# EAGLE schematic norsid (EAGLE 9.6.2)
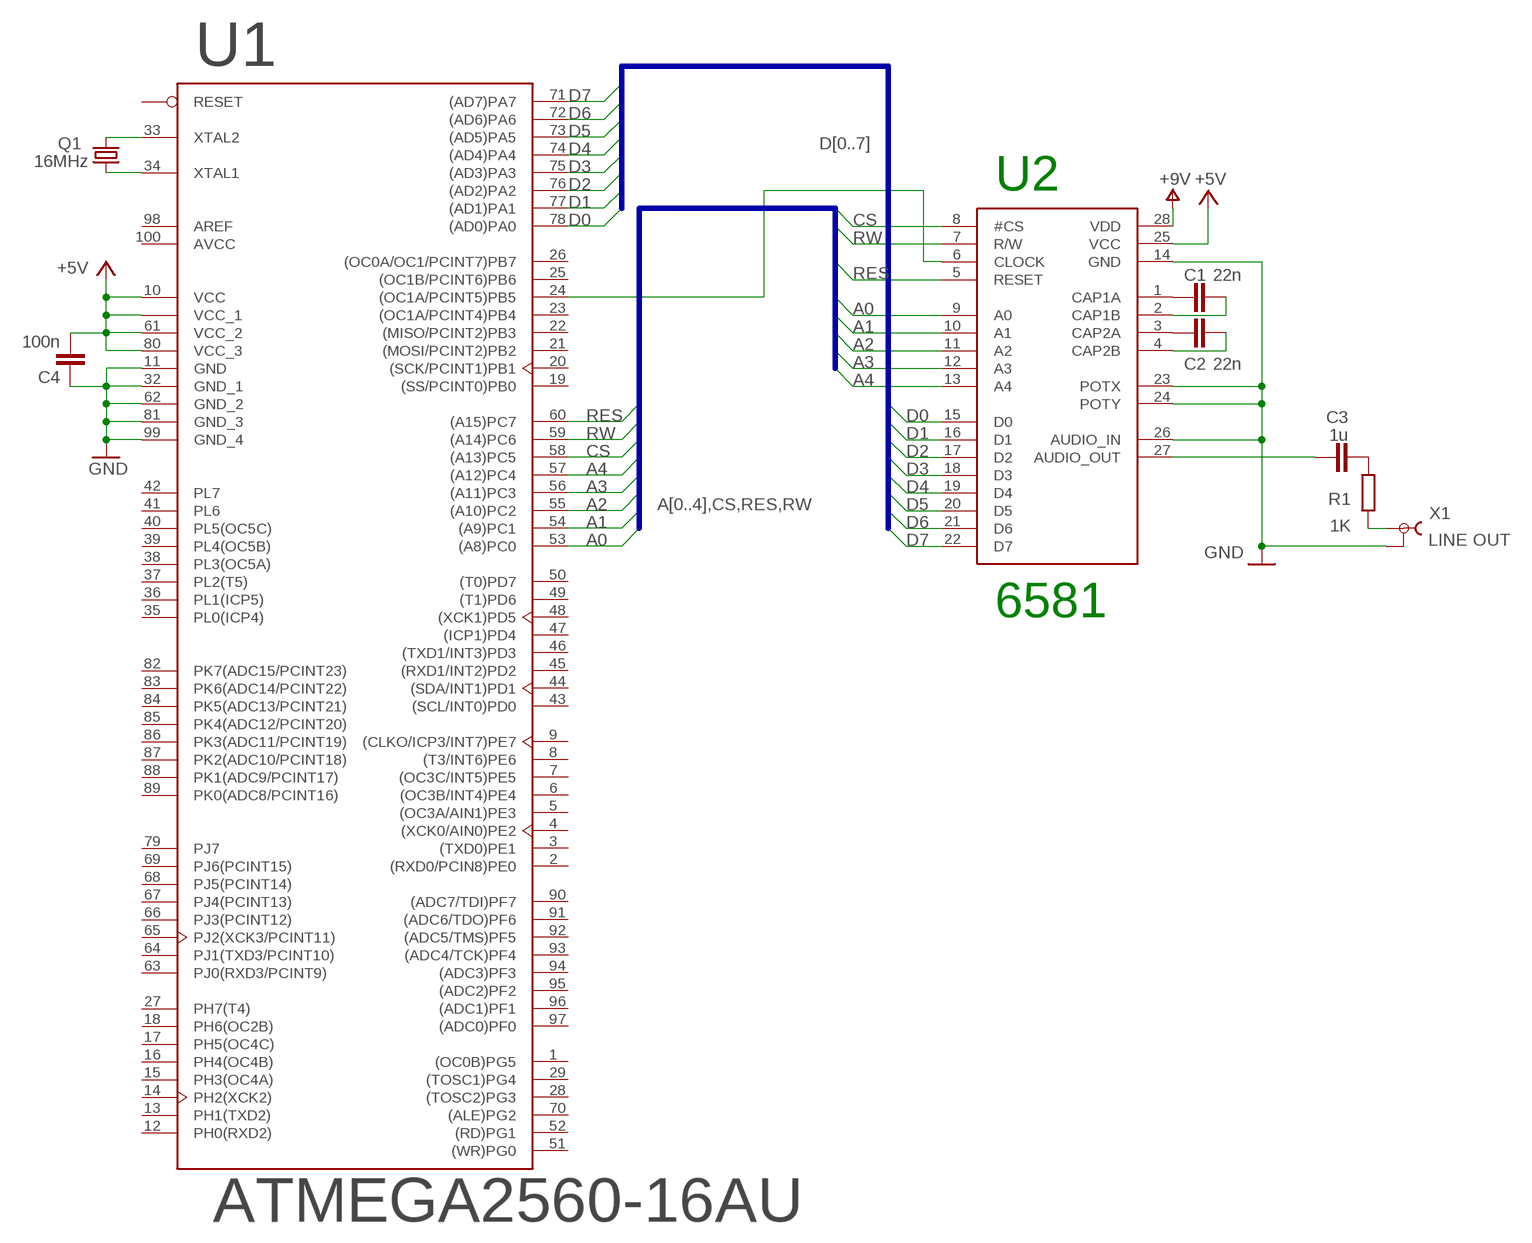
[diagram p0: schematic, sheet 1]

## Parts
C1  22n  C2.5/2  [C2.5-2]
C2  22n  C2.5/2  [C2.5-2]
C3  1u  C2.5/2  [C2.5-2]
C4  100n  C2.5/2  [C2.5-2]
Q1  16MHz  CRYSTALHC49U70  [HC49U70]
R1  1K  R  (no package)
U1  ATMEGA2560-16AU  [TQFP-100]
U2  6581  [DIL28-6]
X1  LINE OUT  TOBU3  [TOBU3]

## Nets
+5V: C4.2 U1.10(VCC) U1.31(VCC_1) U1.61(VCC_2) U1.80(VCC_3)
A0: U1.53((A8)PC0) U2.9(A0)
A1: U1.54((A9)PC1) U2.10(A1)
A2: U1.55((A10)PC2) U2.11(A2)
A3: U1.56((A11)PC3) U2.12(A3)
A4: U1.57((A12)PC4) U2.13(A4)
CS: U1.58((A13)PC5) U2.8(#CS)
D0: U1.78((AD0)PA0) U2.15(D0)
D1: U1.77((AD1)PA1) U2.16(D1)
D2: U1.76((AD2)PA2) U2.17(D2)
D3: U1.75((AD3)PA3) U2.18(D3)
D4: U1.74((AD4)PA4) U2.19(D4)
D5: U1.73((AD5)PA5) U2.20(D5)
D6: U1.72((AD6)PA6) U2.21(D6)
D7: U1.71((AD7)PA7) U2.22(D7)
GND: C4.1 U1.11(GND) U1.32(GND_1) U1.62(GND_2) U1.81(GND_3) U1.99(GND_4)
N$1: C1.1 U2.1(CAP1A)
N$2: C2.1 U2.3(CAP2A)
N$3: U2.14(GND) U2.23(POTX) U2.24(POTY) U2.26(AUDIO_IN) X1.2 X1.2@1 X1.2@2 ; supply symbol labelled GND
N$4: U1.24((OC1A/PCINT5)PB5) U2.6(CLOCK)
N$5: C3.1 U2.27(AUDIO_OUT)
N$6: R1.1 X1.1
N$7: C3.2 R1.2
N$9: C1.2 U2.2(CAP1B)
N$10: C2.2 U2.4(CAP2B)
N$17: Q1.2 U1.33(XTAL2)
N$18: Q1.1 U1.34(XTAL1)
RES: U1.60((A15)PC7) U2.5(RESET)
RW: U1.59((A14)PC6) U2.7(R/W)
V+: U2.28(VDD) ; supply symbol labelled +9V
VCC: U2.25(VCC) ; supply symbol labelled +5V
Unconnected: U1.1((OC0B)PG5) U1.2((RXD0/PCIN8)PE0) U1.3((TXD0)PE1) U1.4((XCK0/AIN0)PE2) U1.5((OC3A/AIN1)PE3) U1.6((OC3B/INT4)PE4) U1.7((OC3C/INT5)PE5) U1.8((T3/INT6)PE6) U1.9((CLKO/ICP3/INT7)PE7) U1.12(PH0(RXD2)) U1.13(PH1(TXD2)) U1.14(PH2(XCK2)) U1.15(PH3(OC4A)) U1.16(PH4(OC4B)) U1.17(PH5(OC4C)) U1.18(PH6(OC2B)) U1.19((SS/PCINT0)PB0) U1.20((SCK/PCINT1)PB1) U1.21((MOSI/PCINT2)PB2) U1.22((MISO/PCINT2)PB3) U1.23((OC1A/PCINT4)PB4) U1.25((OC1B/PCINT6)PB6) U1.26((OC0A/OC1/PCINT7)PB7) U1.27(PH7(T4)) U1.28((TOSC2)PG3) U1.29((TOSC1)PG4) U1.35(PL0(ICP4)) U1.36(PL1(ICP5)) U1.37(PL2(T5)) U1.38(PL3(OC5A)) U1.39(PL4(OC5B)) U1.40(PL5(OC5C)) U1.41(PL6) U1.42(PL7) U1.43((SCL/INT0)PD0) U1.44((SDA/INT1)PD1) U1.45((RXD1/INT2)PD2) U1.46((TXD1/INT3)PD3) U1.47((ICP1)PD4) U1.48((XCK1)PD5) U1.49((T1)PD6) U1.50((T0)PD7) U1.51((WR)PG0) U1.52((RD)PG1) U1.63(PJ0(RXD3/PCINT9)) U1.64(PJ1(TXD3/PCINT10)) U1.65(PJ2(XCK3/PCINT11)) U1.66(PJ3(PCINT12)) U1.67(PJ4(PCINT13)) U1.68(PJ5(PCINT14)) U1.69(PJ6(PCINT15)) U1.70((ALE)PG2) U1.79(PJ7) U1.82(PK7(ADC15/PCINT23)) U1.83(PK6(ADC14/PCINT22)) U1.84(PK5(ADC13/PCINT21)) U1.85(PK4(ADC12/PCINT20)) U1.86(PK3(ADC11/PCINT19)) U1.87(PK2(ADC10/PCINT18)) U1.88(PK1(ADC9/PCINT17)) U1.89(PK0(ADC8/PCINT16)) U1.90((ADC7/TDI)PF7) U1.91((ADC6/TDO)PF6) U1.92((ADC5/TMS)PF5) U1.93((ADC4/TCK)PF4) U1.94((ADC3)PF3) U1.95((ADC2)PF2) U1.96((ADC1)PF1) U1.97((ADC0)PF0)

## Buses
D[0..7]
A[0..4],CS,RES,RW

## Notes on the sheet
- U2
- 6581

## Power pins joined to a net without a drawn wire
AREF: U1.98(AREF)
AVCC: U1.100(AVCC)
RESET: U1.30(RESET)

## Library data of the parts
C1-C4 = capacitor-wima:C: CAPACITOR naming: grid - package width
Q1 = crystal:CRYSTAL: CRYSTAL; OC_FARNELL: unknown; OC_NEWARK: unknown
R1 = ngspice-simulation:R: RESISTOR
U1 = Microcontroller:ATMEGA2560-16AU: IC MCU 8BIT 256KB FLASH 100TQFP Manufacturer's datasheet <http://ww1.microchip.com/downloads/en/DeviceDoc/Atmel-2549-8-bit-AVR-Microcontroller-ATmega640-1280-1281-2560-2561_Summary.pdf>; CREATED_BY: PCBLayout.com; DIGIKEY_PART_NUMBER: ATMEGA2560-16AU-ND; MANUFACTURER: Microchip Technology; MPN: ATMEGA2560-16AU; PACKAGE: TQFP-100
U2 = Mos6581_sid:6581: The Famous C64 Sound Chip - MOS6581
X1 = con-hirschmann:TOBU3: Female Cinch CONNECTOR ( RCA Jack ); MF: FARNELL; MPN: TOBU 3; OC_FARNELL: 592791; OC_NEWARK: 06WX5914